# Altium schematic sheet Connectors.SchDoc
size A4
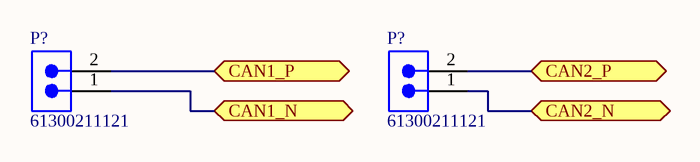
[diagram p0: Connectors.SchDoc]

## Parts
(Parts that share a designator on the sheet are numbered #1, #2 ... from top to bottom, then left to right.)
P?#1  61300211121  [61300211121]
P?#2  61300211121  [61300211121]

## Ports
CAN1_N (bidir), CAN1_P (bidir), CAN2_N (bidir), CAN2_P (bidir)

## Nets
CAN1_N: P?#1.1 ; port CAN1_N
CAN1_P: P?#1.2 ; port CAN1_P
CAN2_N: P?#2.1 ; port CAN2_N
CAN2_P: P?#2.2 ; port CAN2_P

## Library data of the parts
P?#1 P?#2 = CMP-1712-00002-5: NexarPartId: 20081794; Operating Supply Voltage: 250V; Current Rating: 3A; Gender: Male; Number of Contacts: 2; Pitch: 2.54mm; Connector Type: Male Pin; Contact Resistance: 20mΩ; Contact Plating: Gold; Contact Material: Copper; Number of Pins: 2; Min Operating Temperature: -40°C; Packaging: Bulk; Lead Pitch: 2.54mm; Mount: Through Hole; Orientation: Vertical; RoHS: Compliant; REACH SVHC: No SVHC; Height: 8.94mm; Termination: Through Hole; Number of Positions: 2; Contact Mating Length: 5.9944mm; Color: Black; Contact Gender: Male; Number of Rows: 1; Housing Material: PBT; Lead Free: Lead Free; Voltage Rating: 250V; Max Operating Temperature: 125°C